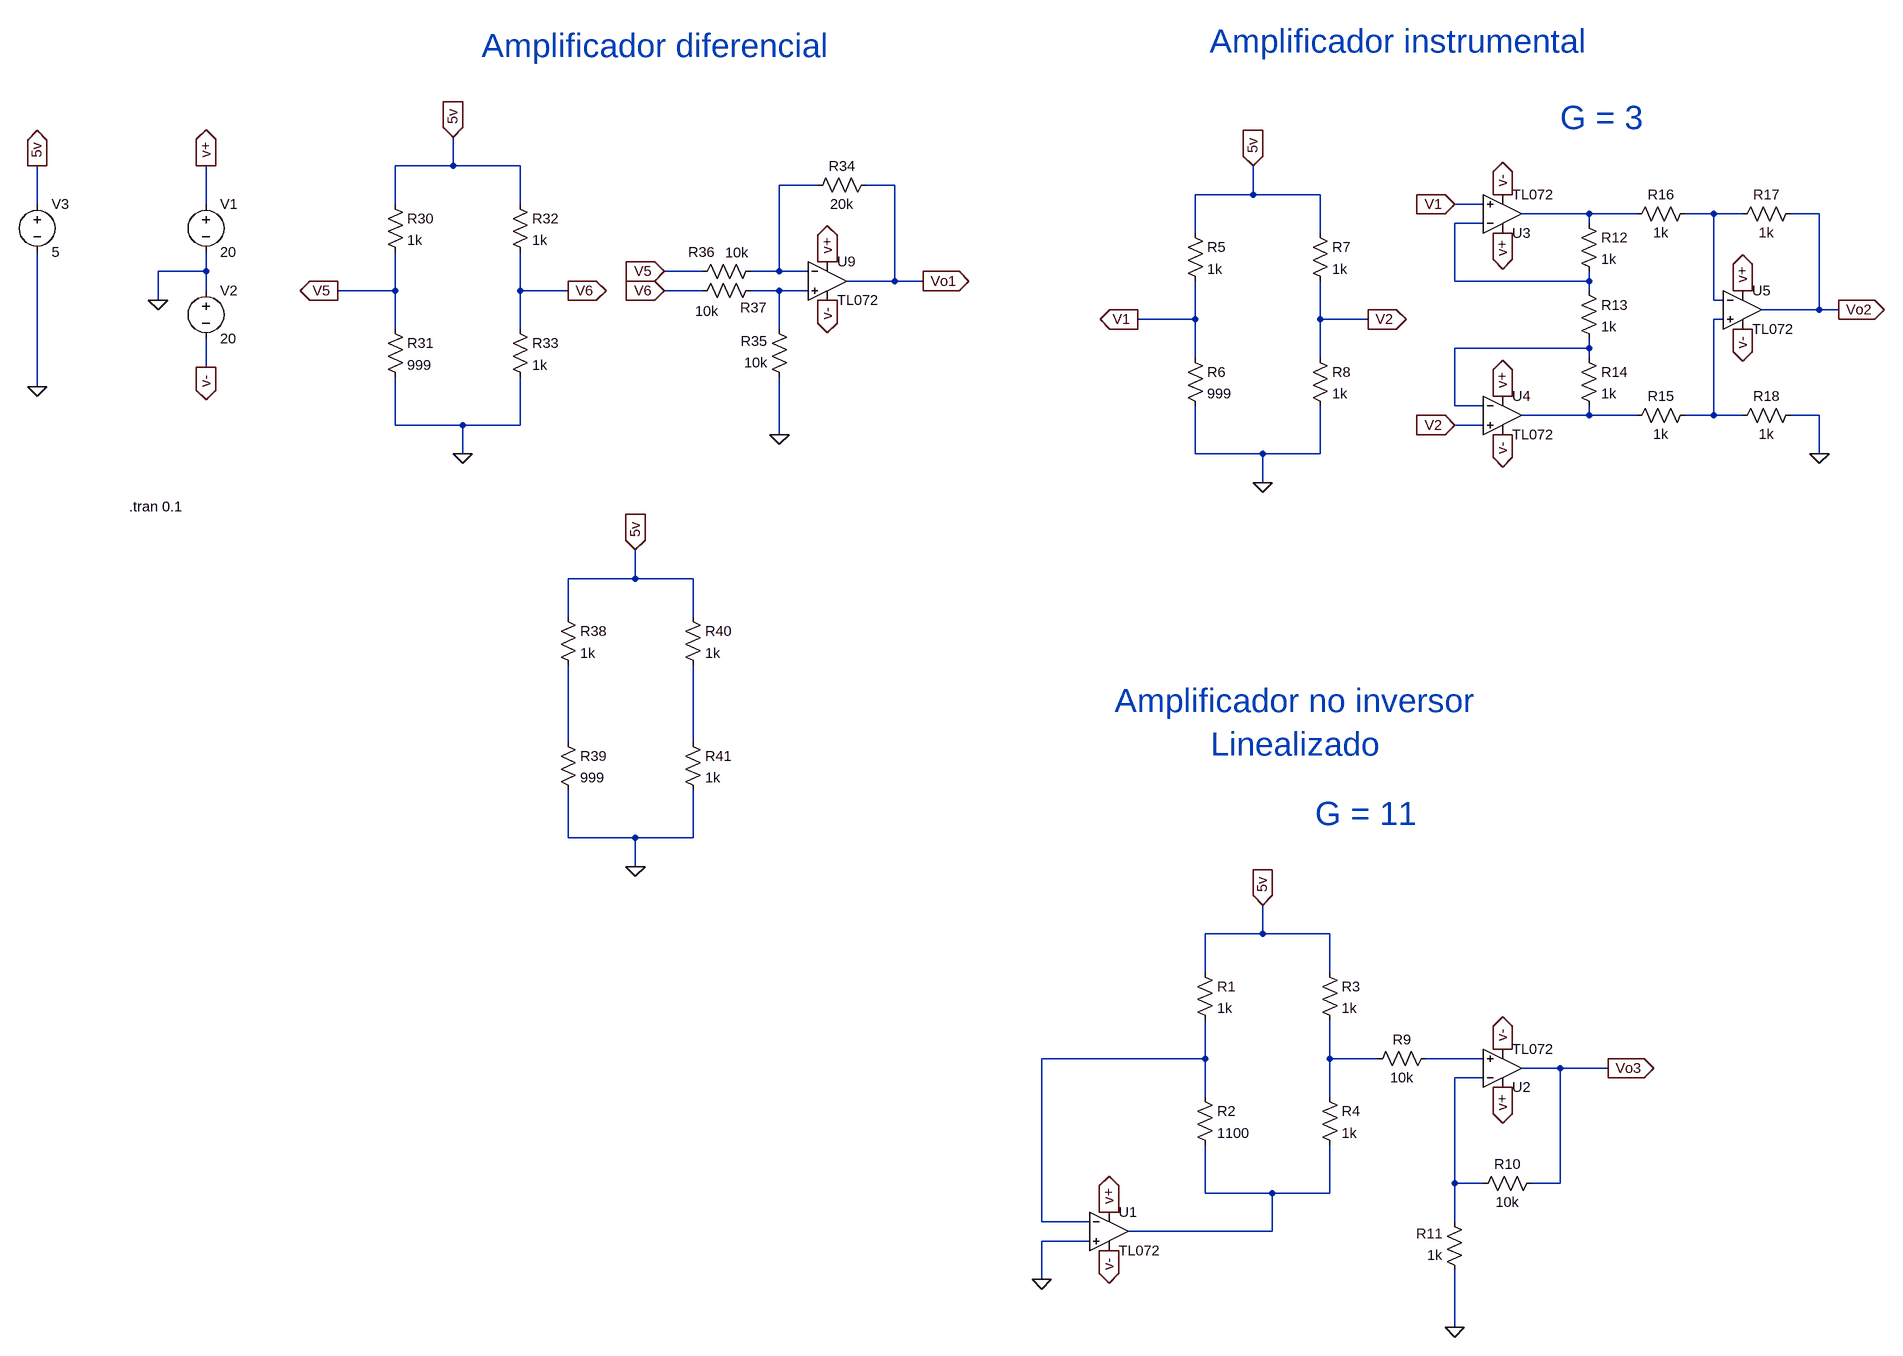
[diagram p0: schematic Wheatstone.asc]
Wheatstone.asc, the LTspice schematic file:
Version 4
SHEET 1 5540 2500
WIRE -128 -48 -128 -96
WIRE -128 -48 -224 -48
WIRE -16 -48 -128 -48
WIRE 480 -16 416 -16
WIRE 608 -16 560 -16
WIRE 2192 0 2192 -48
WIRE 2192 0 2096 0
WIRE 2304 0 2192 0
WIRE -976 16 -976 -48
WIRE -688 16 -688 -48
WIRE -224 16 -224 -48
WIRE -16 16 -16 -48
WIRE 2576 16 2528 16
WIRE 2752 32 2640 32
WIRE 2832 32 2752 32
WIRE 2960 32 2912 32
WIRE 3008 32 2960 32
WIRE 3136 32 3088 32
WIRE 2576 48 2528 48
WIRE 2752 48 2752 32
WIRE 2096 64 2096 0
WIRE 2304 64 2304 0
WIRE -688 128 -688 96
WIRE -688 128 -768 128
WIRE 288 128 224 128
WIRE 416 128 416 -16
WIRE 416 128 368 128
WIRE 464 128 416 128
WIRE 608 144 608 -16
WIRE 608 144 528 144
WIRE 656 144 608 144
WIRE 2528 144 2528 48
WIRE 2752 144 2752 128
WIRE 2752 144 2528 144
WIRE -688 160 -688 128
WIRE -224 160 -224 96
WIRE -224 160 -320 160
WIRE -16 160 -16 96
WIRE 64 160 -16 160
WIRE 288 160 224 160
WIRE 416 160 368 160
WIRE 464 160 416 160
WIRE 2752 160 2752 144
WIRE -768 176 -768 128
WIRE 2960 176 2960 32
WIRE 2976 176 2960 176
WIRE 3136 192 3136 32
WIRE 3136 192 3040 192
WIRE 3168 192 3136 192
WIRE 2096 208 2096 144
WIRE 2096 208 2000 208
WIRE 2304 208 2304 144
WIRE 2384 208 2304 208
WIRE 2976 208 2960 208
WIRE -224 224 -224 160
WIRE -16 224 -16 160
WIRE 416 224 416 160
WIRE 2752 256 2752 240
WIRE 2752 256 2528 256
WIRE 2096 272 2096 208
WIRE 2304 272 2304 208
WIRE 2752 272 2752 256
WIRE -688 288 -688 240
WIRE -976 320 -976 96
WIRE 2528 352 2528 256
WIRE 2576 352 2528 352
WIRE 2752 368 2752 352
WIRE 2752 368 2640 368
WIRE 2832 368 2752 368
WIRE 2960 368 2960 208
WIRE 2960 368 2912 368
WIRE 3008 368 2960 368
WIRE 3136 368 3088 368
WIRE -224 384 -224 304
WIRE -112 384 -224 384
WIRE -16 384 -16 304
WIRE -16 384 -112 384
WIRE 2576 384 2528 384
WIRE 416 400 416 304
WIRE -112 432 -112 384
WIRE 2096 432 2096 352
WIRE 2208 432 2096 432
WIRE 2304 432 2304 352
WIRE 2304 432 2208 432
WIRE 3136 432 3136 368
WIRE 2208 480 2208 432
WIRE 176 640 176 592
WIRE 176 640 64 640
WIRE 272 640 176 640
WIRE 64 704 64 640
WIRE 272 704 272 640
WIRE 64 912 64 784
WIRE 272 912 272 784
WIRE 64 1072 64 992
WIRE 176 1072 64 1072
WIRE 272 1072 272 992
WIRE 272 1072 176 1072
WIRE 176 1120 176 1072
WIRE 2208 1232 2208 1184
WIRE 2208 1232 2112 1232
WIRE 2320 1232 2208 1232
WIRE 2112 1296 2112 1232
WIRE 2320 1296 2320 1232
WIRE 2112 1440 2112 1376
WIRE 2112 1440 1840 1440
WIRE 2320 1440 2320 1376
WIRE 2400 1440 2320 1440
WIRE 2576 1440 2480 1440
WIRE 2704 1456 2640 1456
WIRE 2784 1456 2704 1456
WIRE 2576 1472 2528 1472
WIRE 2112 1504 2112 1440
WIRE 2320 1504 2320 1440
WIRE 2528 1648 2528 1472
WIRE 2576 1648 2528 1648
WIRE 2704 1648 2704 1456
WIRE 2704 1648 2656 1648
WIRE 2112 1664 2112 1584
WIRE 2224 1664 2112 1664
WIRE 2320 1664 2320 1584
WIRE 2320 1664 2224 1664
WIRE 1840 1712 1840 1440
WIRE 1920 1712 1840 1712
WIRE 2528 1712 2528 1648
WIRE 2224 1728 2224 1664
WIRE 2224 1728 1984 1728
WIRE 1920 1744 1840 1744
WIRE 1840 1808 1840 1744
WIRE 2528 1888 2528 1792
FLAG -768 176 0
FLAG -688 -48 v+
IOPIN -688 -48 Out
FLAG -688 288 v-
IOPIN -688 288 Out
FLAG 1952 1696 v+
IOPIN 1952 1696 Out
FLAG 1952 1760 v-
IOPIN 1952 1760 Out
FLAG 1840 1808 0
FLAG 2208 1184 5v
IOPIN 2208 1184 In
FLAG 2192 -48 5v
IOPIN 2192 -48 In
FLAG 2608 1488 v+
IOPIN 2608 1488 Out
FLAG 2608 1424 v-
IOPIN 2608 1424 Out
FLAG 2528 1888 0
FLAG 2608 64 v+
IOPIN 2608 64 Out
FLAG 2608 0 v-
IOPIN 2608 0 Out
FLAG 2208 480 0
FLAG 2000 208 V1
IOPIN 2000 208 Out
FLAG 2384 208 V2
IOPIN 2384 208 Out
FLAG 2608 336 v+
IOPIN 2608 336 Out
FLAG 2608 400 v-
IOPIN 2608 400 Out
FLAG 3008 160 v+
IOPIN 3008 160 Out
FLAG 3008 224 v-
IOPIN 3008 224 Out
FLAG 2528 16 V1
IOPIN 2528 16 In
FLAG 2528 384 V2
IOPIN 2528 384 In
FLAG 3136 432 0
FLAG -976 -48 5v
IOPIN -976 -48 Out
FLAG -976 320 0
FLAG -128 -96 5v
IOPIN -128 -96 In
FLAG -112 432 0
FLAG -320 160 V5
IOPIN -320 160 Out
FLAG 64 160 V6
IOPIN 64 160 Out
FLAG 496 112 v+
IOPIN 496 112 Out
FLAG 496 176 v-
IOPIN 496 176 Out
FLAG 416 400 0
FLAG 224 128 V5
IOPIN 224 128 In
FLAG 224 160 V6
IOPIN 224 160 In
FLAG 176 592 5v
IOPIN 176 592 In
FLAG 176 1120 0
FLAG 656 144 Vo1
IOPIN 656 144 Out
FLAG 3168 192 Vo2
IOPIN 3168 192 Out
FLAG 2784 1456 Vo3
IOPIN 2784 1456 Out
SYMBOL res 2096 1280 R0
SYMATTR InstName R1
SYMATTR Value 1k
SYMBOL res 2096 1488 R0
SYMATTR InstName R2
SYMATTR Value 1100
SYMBOL res 2304 1280 R0
SYMATTR InstName R3
SYMATTR Value 1k
SYMBOL res 2304 1488 R0
SYMATTR InstName R4
SYMATTR Value 1k
SYMBOL AutoGenerated\\TL072 1952 1728 R0
SYMATTR InstName U1
SYMBOL voltage -688 0 R0
WINDOW 123 0 0 Left 0
WINDOW 39 0 0 Left 0
SYMATTR InstName V1
SYMATTR Value 20
SYMBOL voltage -688 144 R0
WINDOW 123 0 0 Left 0
WINDOW 39 0 0 Left 0
SYMATTR InstName V2
SYMATTR Value 20
SYMBOL res 2080 48 R0
SYMATTR InstName R5
SYMATTR Value 1k
SYMBOL res 2080 256 R0
SYMATTR InstName R6
SYMATTR Value 999
SYMBOL res 2288 48 R0
SYMATTR InstName R7
SYMATTR Value 1k
SYMBOL res 2288 256 R0
SYMATTR InstName R8
SYMATTR Value 1k
SYMBOL AutoGenerated\\TL072 2608 1456 M180
SYMATTR InstName U2
SYMBOL res 2496 1424 R90
WINDOW 0 0 56 VBottom 2
WINDOW 3 32 56 VTop 2
SYMATTR InstName R9
SYMATTR Value 10k
SYMBOL res 2672 1632 R90
WINDOW 0 0 56 VBottom 2
WINDOW 3 32 56 VTop 2
SYMATTR InstName R10
SYMATTR Value 10k
SYMBOL res 2544 1808 R180
WINDOW 0 36 76 Left 2
WINDOW 3 36 40 Left 2
SYMATTR InstName R11
SYMATTR Value 1k
SYMBOL AutoGenerated\\TL072 2608 32 M180
SYMATTR InstName U3
SYMBOL AutoGenerated\\TL072 2608 368 R0
SYMATTR InstName U4
SYMBOL AutoGenerated\\TL072 3008 192 R0
SYMATTR InstName U5
SYMBOL res 2736 32 R0
SYMATTR InstName R12
SYMATTR Value 1k
SYMBOL res 2736 144 R0
SYMATTR InstName R13
SYMATTR Value 1k
SYMBOL res 2736 256 R0
SYMATTR InstName R14
SYMATTR Value 1k
SYMBOL res 2928 352 R90
WINDOW 0 0 56 VBottom 2
WINDOW 3 32 56 VTop 2
SYMATTR InstName R15
SYMATTR Value 1k
SYMBOL res 2928 16 R90
WINDOW 0 0 56 VBottom 2
WINDOW 3 32 56 VTop 2
SYMATTR InstName R16
SYMATTR Value 1k
SYMBOL res 3104 16 R90
WINDOW 0 0 56 VBottom 2
WINDOW 3 32 56 VTop 2
SYMATTR InstName R17
SYMATTR Value 1k
SYMBOL res 3104 352 R90
WINDOW 0 0 56 VBottom 2
WINDOW 3 32 56 VTop 2
SYMATTR InstName R18
SYMATTR Value 1k
SYMBOL voltage -976 0 R0
WINDOW 123 0 0 Left 0
WINDOW 39 0 0 Left 0
SYMATTR InstName V3
SYMATTR Value 5
SYMBOL res -240 0 R0
SYMATTR InstName R30
SYMATTR Value 1k
SYMBOL res -240 208 R0
SYMATTR InstName R31
SYMATTR Value 999
SYMBOL res -32 0 R0
SYMATTR InstName R32
SYMATTR Value 1k
SYMBOL res -32 208 R0
SYMATTR InstName R33
SYMATTR Value 1k
SYMBOL AutoGenerated\\TL072 496 144 R0
SYMATTR InstName U9
SYMBOL res 576 -32 R90
WINDOW 0 0 56 VBottom 2
WINDOW 3 32 56 VTop 2
SYMATTR InstName R34
SYMATTR Value 20k
SYMBOL res 432 320 R180
WINDOW 0 36 76 Left 2
WINDOW 3 36 40 Left 2
SYMATTR InstName R35
SYMATTR Value 10k
SYMBOL res 384 112 R90
WINDOW 0 0 98 VBottom 2
WINDOW 3 -31 39 VTop 2
SYMATTR InstName R36
SYMATTR Value 10k
SYMBOL res 384 144 R90
WINDOW 0 60 11 VBottom 2
WINDOW 3 35 89 VTop 2
SYMATTR InstName R37
SYMATTR Value 10k
SYMBOL res 48 688 R0
SYMATTR InstName R38
SYMATTR Value 1k
SYMBOL res 48 896 R0
SYMATTR InstName R39
SYMATTR Value 999
SYMBOL res 256 688 R0
SYMATTR InstName R40
SYMATTR Value 1k
SYMBOL res 256 896 R0
SYMATTR InstName R41
SYMATTR Value 1k
TEXT -816 520 Left 2 !.tran 0.1
TEXT 2296 1032 Left 5 ;G = 11
TEXT 2704 -128 Left 5 ;G = 3
TEXT -80 -248 Left 5 ;Amplificador diferencial
TEXT 2120 -256 Left 5 ;Amplificador instrumental
TEXT 2264 880 Center 5 ;Amplificador no inversor\nLinealizado

The netlist it stands for:
* Wheatstone.asc
R1 5v N011 1k
R2 N011 N015 1100
R3 5v N012 1k
R4 N012 N015 1k
* U1: TL072 (symbol AutoGenerated\TL072 not available, pins judged from their places): In+=0 In-=N011 V+=v+ V-=v- OUT=N015
V1 v+ 0 20
V2 0 v- 20
R5 5v V1 1k
R6 V1 0 999
R7 5v V2 1k
R8 V2 0 1k
* U2: TL072 (symbol AutoGenerated\TL072 not available, pins judged from their places): In+=N013 In-=N014 V+=v+ V-=v- OUT=Vo3
R9 N013 N012 10k
R10 Vo3 N014 10k
R11 0 N014 1k
* U3: TL072 (symbol AutoGenerated\TL072 not available, pins judged from their places): In+=V1 In-=N004 V+=v+ V-=v- OUT=N002
* U4: TL072 (symbol AutoGenerated\TL072 not available, pins judged from their places): In+=V2 In-=N007 V+=v+ V-=v- OUT=N008
* U5: TL072 (symbol AutoGenerated\TL072 not available, pins judged from their places): In+=N006 In-=N003 V+=v+ V-=v- OUT=Vo2
R12 N002 N004 1k
R13 N004 N007 1k
R14 N007 N008 1k
R15 N006 N008 1k
R16 N003 N002 1k
R17 Vo2 N003 1k
R18 0 N006 1k
V3 5v 0 5
R30 5v V5 1k
R31 V5 0 999
R32 5v V6 1k
R33 V6 0 1k
* U9: TL072 (symbol AutoGenerated\TL072 not available, pins judged from their places): In+=N005 In-=N001 V+=v+ V-=v- OUT=Vo1
R34 Vo1 N001 20k
R35 0 N005 10k
R36 N001 V5 10k
R37 N005 V6 10k
R38 5v N009 1k
R39 N009 0 999
R40 5v N010 1k
R41 N010 0 1k
.tran 0.1
* G = 11
* G = 3
* Amplificador diferencial
* Amplificador instrumental
* Amplificador no inversor
* Linealizado
.backanno
.end